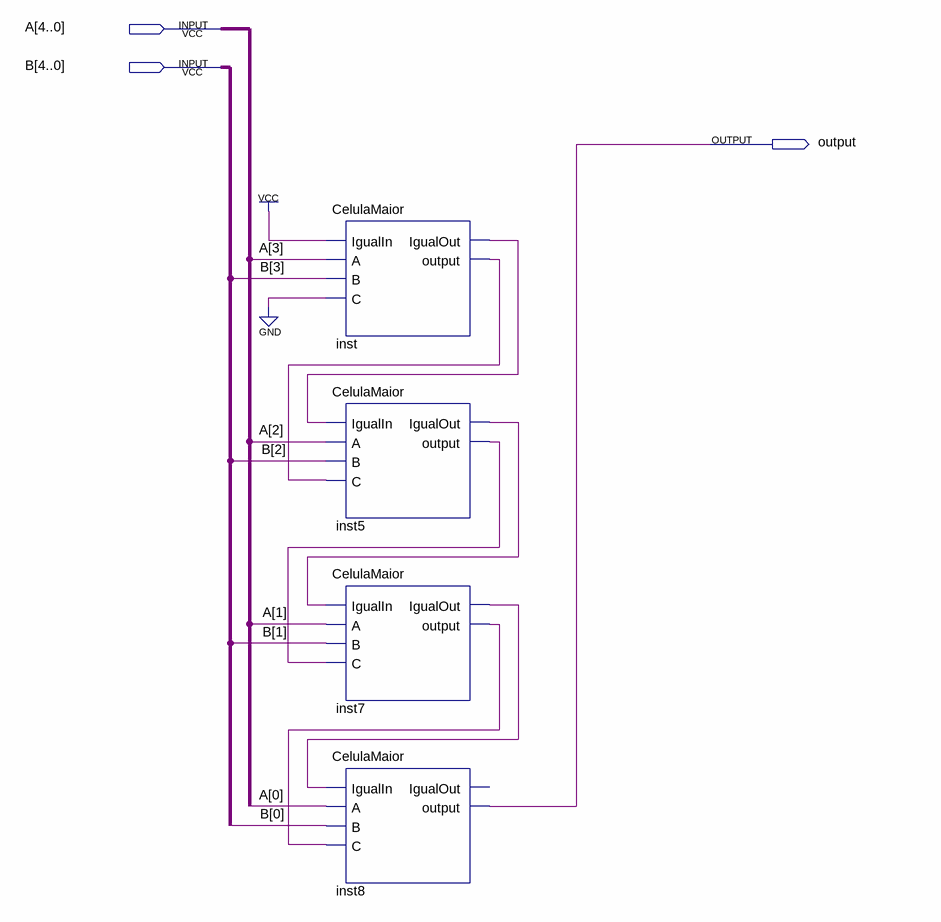
[diagram p0: schematic sheet]
// Quartus schematic MaiorCompleto.bdf as structural Verilog: 4 symbols, 3 pins
module MaiorCompleto (
  input  [4:0] A,
  input  [4:0] B,
  output \output 
);

  wire inst5_igualout, inst5_output, inst7_igualout, inst7_output, inst_igualout, inst_output;

  CelulaMaior inst (.IgualIn(1'b1), .A(A[3]), .B(B[3]), .C(1'b0), .IgualOut(inst_igualout), .\output (inst_output));
  CelulaMaior inst5 (
    .IgualIn(inst_igualout), .A(A[2]), .B(B[2]), .C(inst_output), .IgualOut(inst5_igualout),
    .\output (inst5_output));
  CelulaMaior inst7 (
    .IgualIn(inst5_igualout), .A(A[1]), .B(B[1]), .C(inst5_output), .IgualOut(inst7_igualout),
    .\output (inst7_output));
  CelulaMaior inst8 (
    .IgualIn(inst7_igualout), .A(A[0]), .B(B[0]), .C(inst7_output), .\output (\output ));  // open: IgualOut
endmodule
